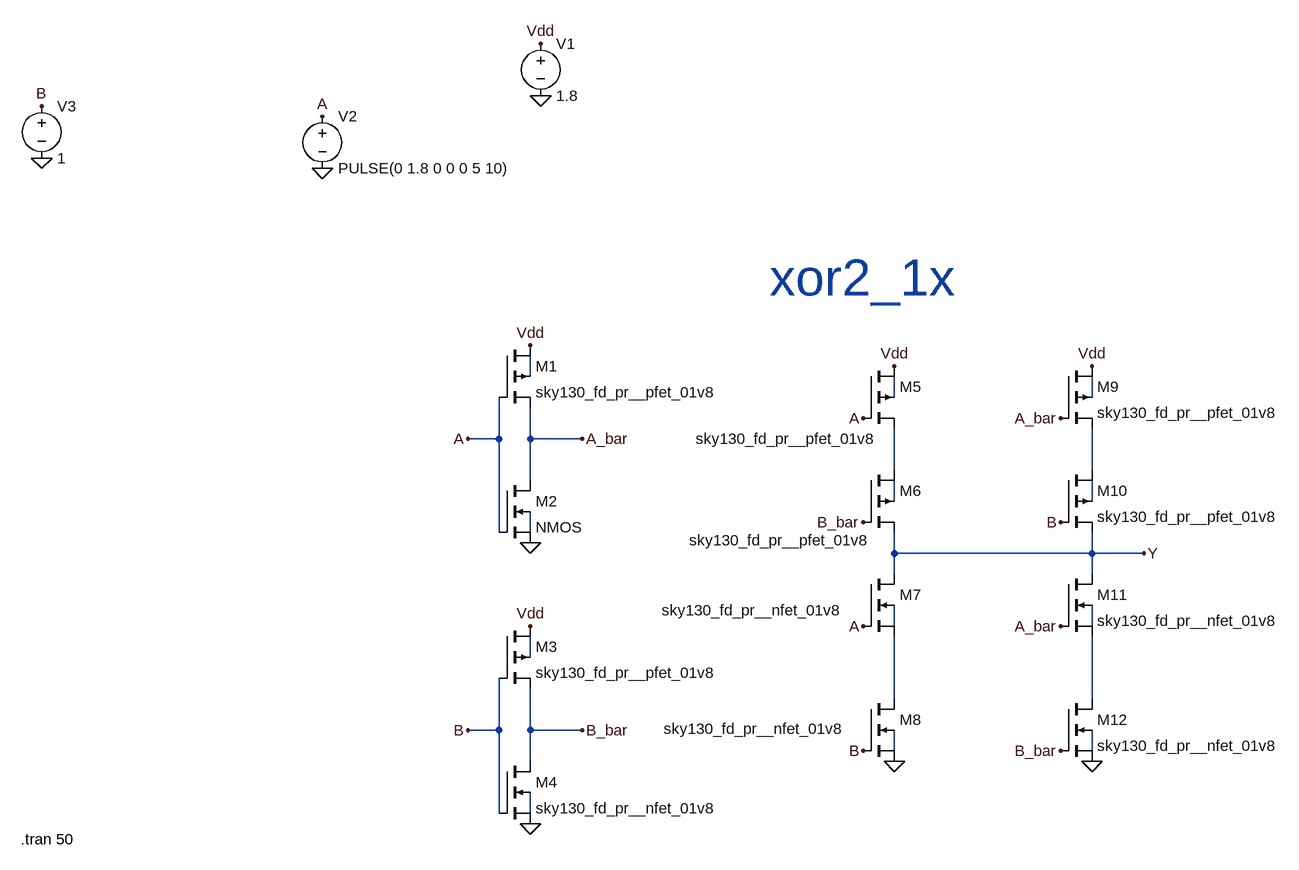
[diagram p0: schematic xor2_1x.asc]
xor2_1x.asc, the LTspice schematic file:
Version 4
SHEET 1 1488 1224
WIRE 304 496 304 464
WIRE 864 528 864 496
WIRE 1168 528 1168 496
WIRE 256 592 256 528
WIRE 256 592 208 592
WIRE 304 592 304 544
WIRE 384 592 304 592
WIRE 864 640 864 576
WIRE 1168 640 1168 576
WIRE 304 656 304 592
WIRE 864 688 864 656
WIRE 1168 688 1168 656
WIRE 256 736 256 592
WIRE 304 736 304 704
WIRE 864 768 864 736
WIRE 1168 768 1168 736
WIRE 1168 768 864 768
WIRE 1248 768 1168 768
WIRE 864 800 864 768
WIRE 1168 800 1168 768
WIRE 864 880 864 848
WIRE 1168 880 1168 848
WIRE 304 928 304 896
WIRE 864 992 864 896
WIRE 1168 992 1168 896
WIRE 256 1040 256 960
WIRE 256 1040 208 1040
WIRE 304 1040 304 976
WIRE 384 1040 304 1040
WIRE 864 1072 864 1040
WIRE 1168 1072 1168 1040
WIRE 304 1088 304 1040
WIRE 256 1168 256 1040
WIRE 304 1168 304 1136
FLAG 320 -16 Vdd
FLAG 320 64 0
FLAG -16 96 A
FLAG -16 176 0
FLAG -448 80 B
FLAG -448 160 0
FLAG 304 752 0
FLAG 304 448 Vdd
FLAG 384 592 A_bar
FLAG 208 592 A
FLAG 304 1184 0
FLAG 304 880 Vdd
FLAG 208 1040 B
FLAG 384 1040 B_bar
FLAG 864 480 Vdd
FLAG 864 1088 0
FLAG 1168 480 Vdd
FLAG 1168 1088 0
FLAG 1248 768 Y
FLAG 816 560 A
FLAG 1120 560 A_bar
FLAG 816 720 B_bar
FLAG 1120 720 B
FLAG 1120 880 A_bar
FLAG 1120 1072 B_bar
FLAG 816 1072 B
FLAG 816 880 A
SYMBOL voltage 320 -32 R0
WINDOW 123 0 0 Left 0
WINDOW 39 0 0 Left 0
SYMATTR InstName V1
SYMATTR Value 1.8
SYMBOL voltage -16 80 R0
WINDOW 123 0 0 Left 0
WINDOW 39 0 0 Left 0
SYMATTR InstName V2
SYMATTR Value PULSE(0 1.8 0 0 0 5 10)
SYMBOL voltage -448 64 R0
WINDOW 123 0 0 Left 0
WINDOW 39 0 0 Left 0
SYMATTR InstName V3
SYMATTR Value 1
SYMBOL nmos4 256 656 R0
SYMATTR InstName M2
SYMATTR Value2 l=0.13u w=0.13u
SYMBOL pmos4 256 448 R0
SYMATTR InstName M1
SYMATTR Value2 l=0.13u w=0.13u
SYMATTR Value sky130_fd_pr__pfet_01v8
SYMBOL nmos4 256 1088 R0
SYMATTR InstName M4
SYMATTR Value2 l=0.13u w=0.13u
SYMATTR Value sky130_fd_pr__nfet_01v8
SYMBOL pmos4 256 880 R0
SYMATTR InstName M3
SYMATTR Value2 l=0.13u w=0.13u
SYMATTR Value sky130_fd_pr__pfet_01v8
SYMBOL pmos4 816 480 R0
WINDOW 3 -258 112 Left 2
SYMATTR InstName M5
SYMATTR Value2 l=0.13u w=0.13u
SYMATTR Value sky130_fd_pr__pfet_01v8
SYMBOL pmos4 816 640 R0
WINDOW 3 -268 108 Left 2
SYMATTR InstName M6
SYMATTR Value2 l=0.13u w=0.13u
SYMATTR Value sky130_fd_pr__pfet_01v8
SYMBOL nmos4 816 800 R0
WINDOW 3 -310 56 Left 2
SYMATTR InstName M7
SYMATTR Value2 l=0.13u w=0.13u
SYMATTR Value sky130_fd_pr__nfet_01v8
SYMBOL nmos4 816 992 R0
WINDOW 3 -307 46 Left 2
SYMATTR InstName M8
SYMATTR Value2 l=0.13u w=0.13u
SYMATTR Value sky130_fd_pr__nfet_01v8
SYMBOL pmos4 1120 480 R0
SYMATTR InstName M9
SYMATTR Value2 l=0.13u w=0.13u
SYMATTR Value sky130_fd_pr__pfet_01v8
SYMBOL pmos4 1120 640 R0
SYMATTR InstName M10
SYMATTR Value2 l=0.13u w=0.13u
SYMATTR Value sky130_fd_pr__pfet_01v8
SYMBOL nmos4 1120 800 R0
SYMATTR InstName M11
SYMATTR Value2 l=0.13u w=0.13u
SYMATTR Value sky130_fd_pr__nfet_01v8
SYMBOL nmos4 1120 992 R0
SYMATTR InstName M12
SYMATTR Value2 l=0.13u w=0.13u
SYMATTR Value sky130_fd_pr__nfet_01v8
TEXT -480 1208 Left 2 !.tran 50
TEXT 672 344 Left 6 ;xor2_1x

The netlist it stands for:
* xor2_1x.asc
V1 Vdd 0 1.8
V2 A 0 PULSE(0 1.8 0 0 0 5 10)
V3 B 0 1
M2 A_bar A 0 N008 NMOS l=0.13u w=0.13u
M1 Vdd A A_bar N001 sky130_fd_pr__pfet_01v8 l=0.13u w=0.13u
M4 B_bar B 0 N016 sky130_fd_pr__nfet_01v8 l=0.13u w=0.13u
M3 Vdd B B_bar N011 sky130_fd_pr__pfet_01v8 l=0.13u w=0.13u
M5 Vdd A N004 N002 sky130_fd_pr__pfet_01v8 l=0.13u w=0.13u
M6 N004 B_bar Y N006 sky130_fd_pr__pfet_01v8 l=0.13u w=0.13u
M7 Y A N012 N009 sky130_fd_pr__nfet_01v8 l=0.13u w=0.13u
M8 N012 B 0 N014 sky130_fd_pr__nfet_01v8 l=0.13u w=0.13u
M9 Vdd A_bar N005 N003 sky130_fd_pr__pfet_01v8 l=0.13u w=0.13u
M10 N005 B Y N007 sky130_fd_pr__pfet_01v8 l=0.13u w=0.13u
M11 Y A_bar N013 N010 sky130_fd_pr__nfet_01v8 l=0.13u w=0.13u
M12 N013 B_bar 0 N015 sky130_fd_pr__nfet_01v8 l=0.13u w=0.13u
.model NMOS NMOS
.model PMOS PMOS
.lib standard.mos
.tran 50
* xor2_1x
.backanno
.end